# Altium schematic sheet SFP.SchDoc
size A4
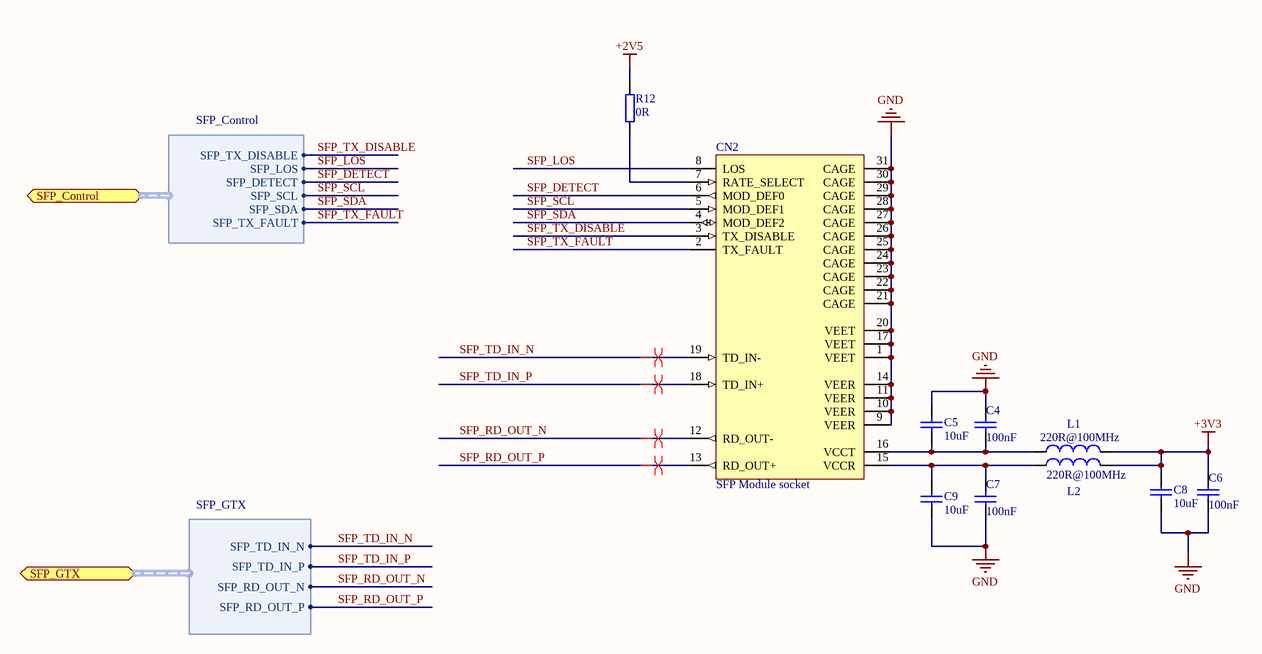
[diagram p0: SFP.SchDoc]

## Parts
C4  100nF  [CC1608-0603]
C5  10uF  [CC1608-0603]
C6  100nF  [CC1608-0603]
C7  100nF  [CC1608-0603]
C8  10uF  [CC1608-0603]
C9  10uF  [CC1608-0603]
CN2  SFP Module socket  [SFP_SINGLE_PORT]
L1  Impedance: 220R@100MHz  [0603]  (hidden comment: 220R@100MHz Ferrite Bead)
L2  Impedance: 220R@100MHz  [0603]  (hidden comment: 220R@100MHz Ferrite Bead)
R12  0R  [0603]

## Ports
SFP_Control (harness SFP_Control), SFP_GTX (harness SFP_GTX)

## Harnesses
SFP_GTX: SFP_TD_IN_N, SFP_TD_IN_P, SFP_RD_OUT_N, SFP_RD_OUT_P
SFP_Control: SFP_DETECT, SFP_LOS, SFP_SCL, SFP_SDA, SFP_TX_FAULT, SFP_TX_DISABLE

## Nets
+2V5: R12.1
+3V3: C6.1 C8.1 L1.2 L2.2
GND: C4.1 C5.1 C6.2 C7.2 C8.2 C9.2 CN2.1(VEET) CN2.9(VEER) CN2.10(VEER) CN2.11(VEER) CN2.14(VEER) CN2.17(VEET) CN2.20(VEET) CN2.21(CAGE) CN2.22(CAGE) CN2.23(CAGE) CN2.24(CAGE) CN2.25(CAGE) CN2.26(CAGE) CN2.27(CAGE) CN2.28(CAGE) CN2.29(CAGE) CN2.30(CAGE) CN2.31(CAGE)
SFP_DETECT: CN2.6(MOD_DEF0) ; port SFP_Control.SFP_DETECT
SFP_LOS: CN2.8(LOS) ; port SFP_Control.SFP_LOS
SFP_RD_OUT_N: CN2.12(RD_OUT-) ; port SFP_GTX.SFP_RD_OUT_N
SFP_RD_OUT_P: CN2.13(RD_OUT+) ; port SFP_GTX.SFP_RD_OUT_P
SFP_SCL: CN2.5(MOD_DEF1) ; port SFP_Control.SFP_SCL
SFP_SDA: CN2.4(MOD_DEF2) ; port SFP_Control.SFP_SDA
SFP_TD_IN_N: CN2.19(TD_IN-) ; port SFP_GTX.SFP_TD_IN_N
SFP_TD_IN_P: CN2.18(TD_IN+) ; port SFP_GTX.SFP_TD_IN_P
SFP_TX_DISABLE: CN2.3(TX_DISABLE) ; port SFP_Control.SFP_TX_DISABLE
SFP_TX_FAULT: CN2.2(TX_FAULT) ; port SFP_Control.SFP_TX_FAULT
NetC4_2: C4.2 C5.2 CN2.16(VCCT) L1.1
NetC7_1: C7.1 C9.1 CN2.15(VCCR) L2.1
NetCN2_7: CN2.7(RATE_SELECT) R12.2

## Layout directives
differential pair: SFP_RD_OUT_N, SFP_RD_OUT_P, SFP_TD_IN_N, SFP_TD_IN_P

## Library data of the parts
C4 C6 C7 = CC0603_100NF_16V_10%_X7R: Capacitor; Manufacturer1: AVX; Manufacturer1 PN: 0603YC104KAT2A; TC: X7R; Tolerance: ±10%; Voltage: 16V; Published: 8-Jun-2000; LatestRevisionDate: 17-Jul-2002; LatestRevisionNote: Re-released for DXP Platform.; PackageReference: RAD-0.3; Publisher: Altium Limited; Distributor1: Digikey; Distributor1 PN: 478-1239-1-ND; Case: 0603; Value: 100nF
C5 C8 C9 = CC0603_10UF_6.3V_20%_X5R: Capacitor; Manufacturer1: TDK; Manufacturer1 PN: C1608X5R0J106M; TC: X5R; Tolerance: ±20%; Voltage: 6.3V; Published: 8-Jun-2000; LatestRevisionDate: 17-Jul-2002; LatestRevisionNote: Re-released for DXP Platform.; PackageReference: RAD-0.3; Publisher: Altium Limited; Distributor1: Digikey; Distributor1 PN: 445-4112-1-ND; Case: 0603; Value: 10uF
CN2 = SFP_SOCKET_SINGLE: Socket for SFP module; RefId: Far/1256176
L1 L2 = L_FERRITE_BEAD: ferrite bead; Manufacturer1: Murata; Manufacturer1 PN: BLM18KG221SN1D; Current Rating: 2.2A; DCR: 50mOhm; Case: 0603; Distributor1: Digikey; Distributor1 PN: 490-5255-1-ND
R12 = R0603_0R_0.1W_JUMPER: SMD Resistor; Manufacturer1: Yageo; Manufacturer1 PN: RC0603JR-070RL; TCR: 200ppm; Power Rating: 0.1W; Case: 0603; Distributor1: DigiKey; Distributor1 PN: 311-0.0GRCT-ND; Tolerance: -; Value: 0R